# Altium schematic sheet mpu_power.SchDoc
size A3; SheetNumber: 4; SheetTotal: 5
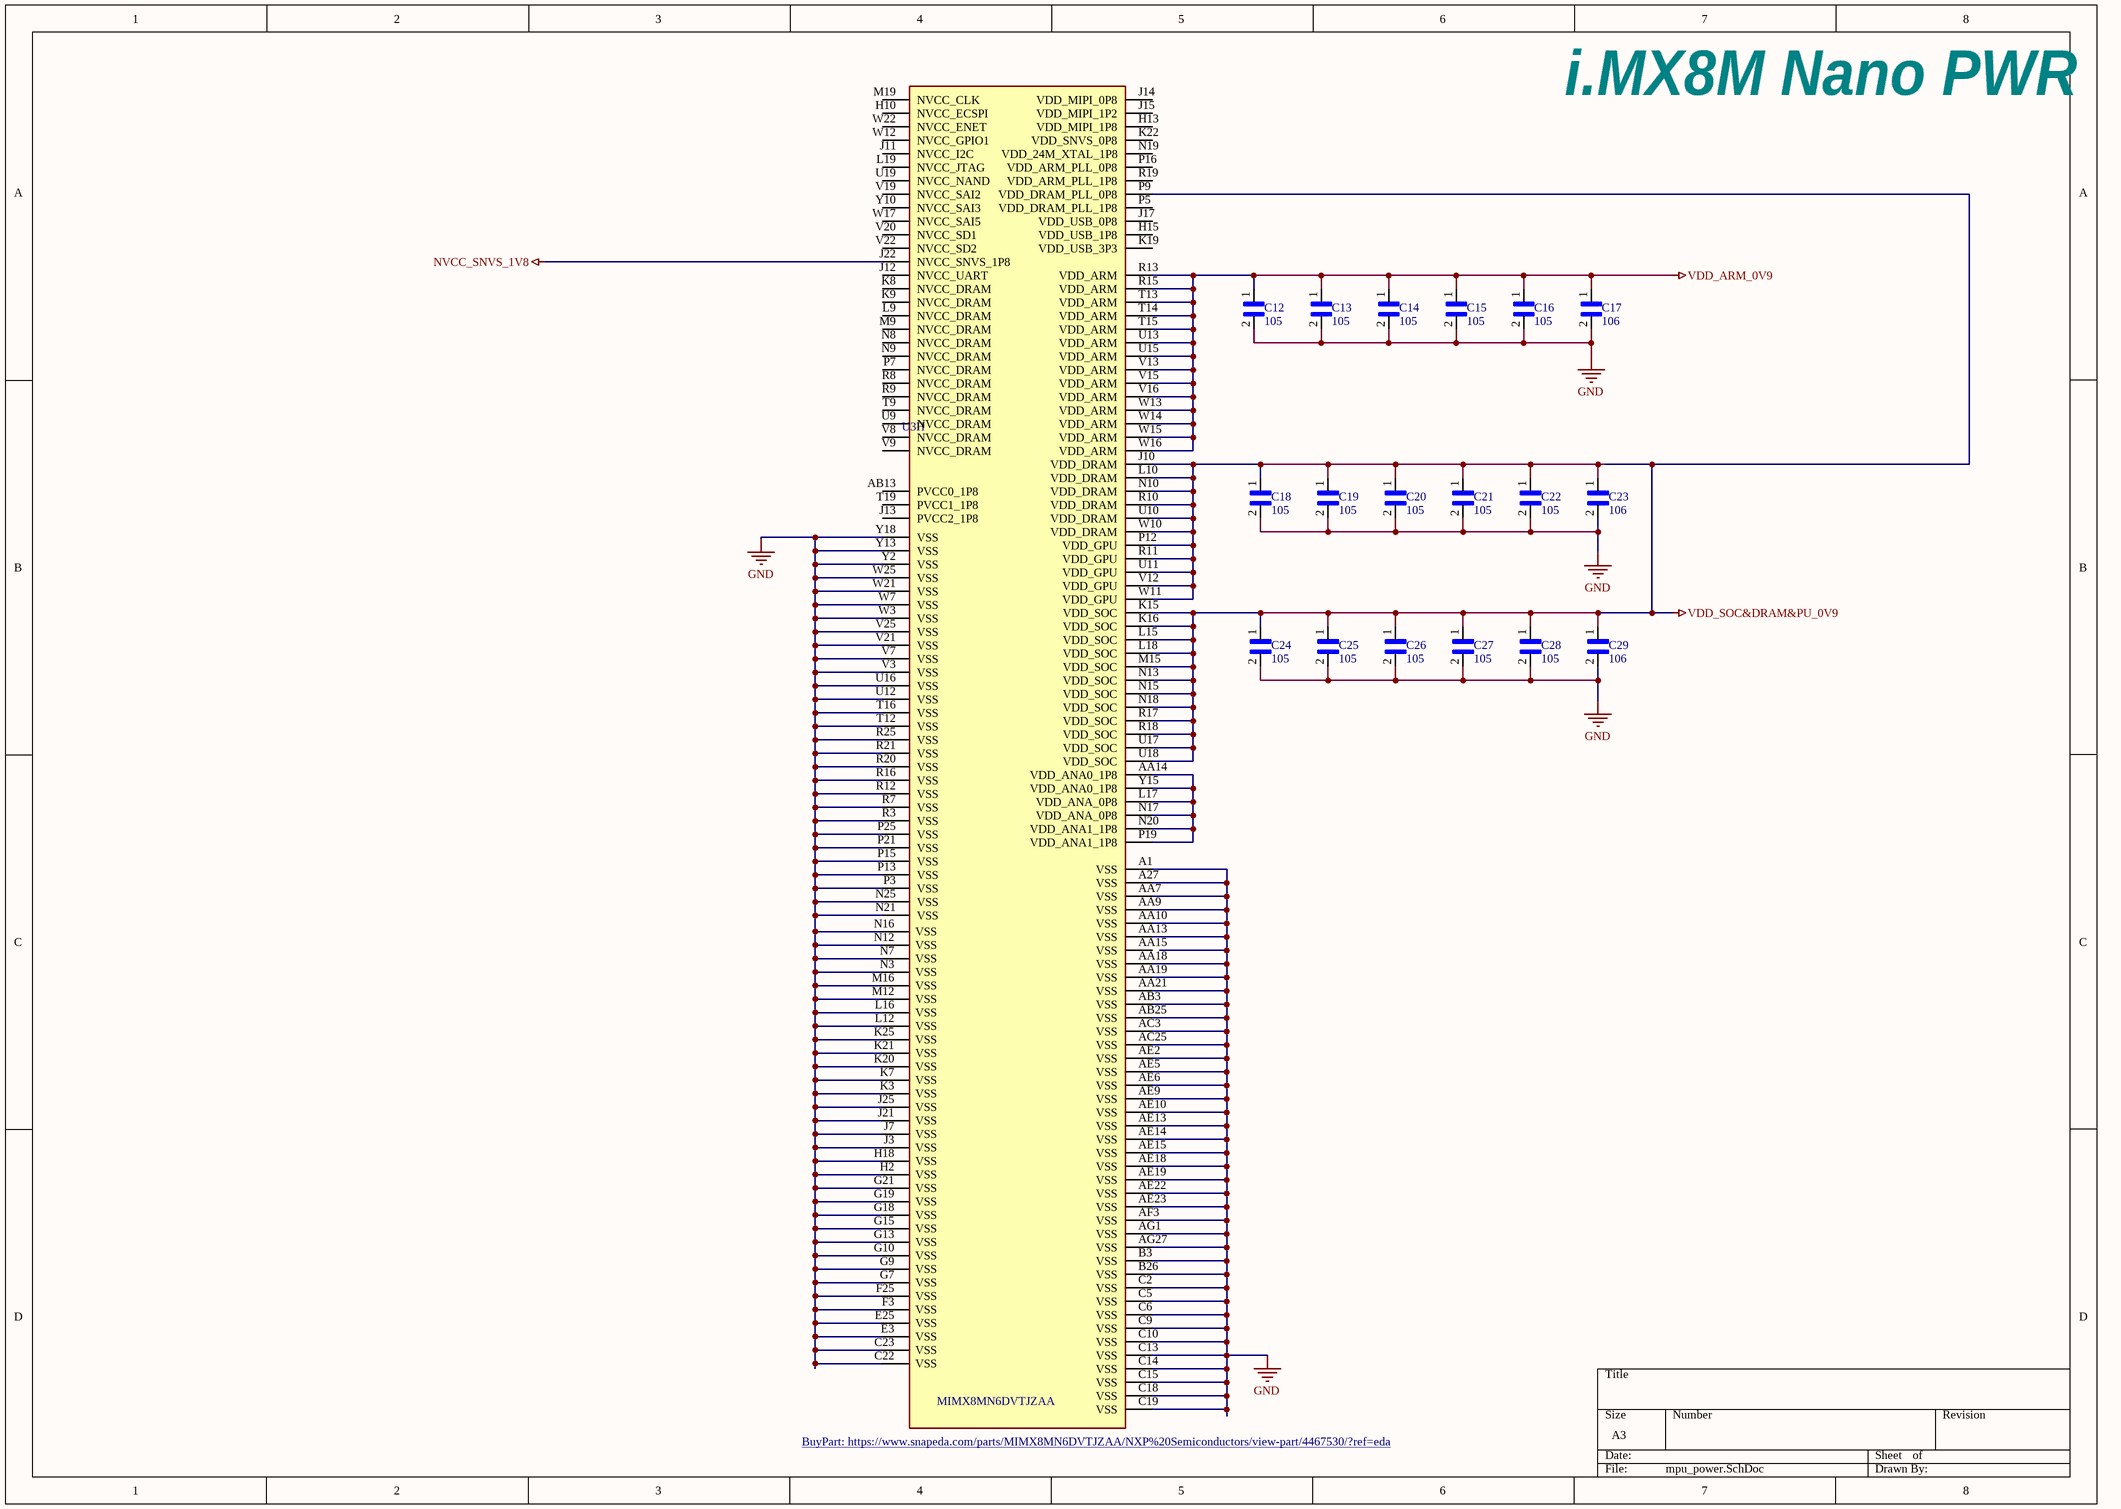
[diagram p0: mpu_power.SchDoc]

## Parts
C12  105  [RC0402]
C13  105  [RC0402]
C14  105  [RC0402]
C15  105  [RC0402]
C16  105  [RC0402]
C17  106  [CL05A106MQ5NUNC]
C18  105  [RC0402]
C19  105  [RC0402]
C20  105  [RC0402]
C21  105  [RC0402]
C22  105  [RC0402]
C23  106  [CL05A106MQ5NUNC]
C24  105  [RC0402]
C25  105  [RC0402]
C26  105  [RC0402]
C27  105  [RC0402]
C28  105  [RC0402]
C29  106  [CL05A106MQ5NUNC]
U3  MIMX8MN6DVTJZAA  [BGA486N50P27X27_1400X1400X125N]  (part H of 8)

## Nets
GND: C12.2 C13.2 C14.2 C15.2 C16.2 C17.2 C18.2 C19.2 C20.2 C21.2 C22.2 C23.2 C24.2 C25.2 C26.2 C27.2 C28.2 C29.2 U3.A1(VSS) U3.A27(VSS) U3.AA7(VSS) U3.AA9(VSS) U3.AA10(VSS) U3.AA13(VSS) U3.AA18(VSS) U3.AA19(VSS) U3.AA21(VSS) U3.AB3(VSS) U3.AB25(VSS) U3.AC3(VSS) U3.AC25(VSS) U3.AE2(VSS) U3.AE5(VSS) U3.AE6(VSS) U3.AE9(VSS) U3.AE10(VSS) U3.AE13(VSS) U3.AE14(VSS) U3.AE15(VSS) U3.AE18(VSS) U3.AE19(VSS) U3.AE22(VSS) U3.AE23(VSS) U3.AF3(VSS) U3.AG1(VSS) U3.AG27(VSS) U3.B3(VSS) U3.B26(VSS) U3.C2(VSS) U3.C5(VSS) U3.C6(VSS) U3.C9(VSS) U3.C10(VSS) U3.C13(VSS) U3.C14(VSS) U3.C15(VSS) U3.C18(VSS) U3.C19(VSS) U3.C22(VSS) U3.C23(VSS) U3.E3(VSS) U3.E25(VSS) U3.F3(VSS) U3.F25(VSS) U3.G7(VSS) U3.G9(VSS) U3.G10(VSS) U3.G13(VSS) U3.G15(VSS) U3.G18(VSS) U3.G19(VSS) U3.G21(VSS) U3.H2(VSS) U3.H18(VSS) U3.J3(VSS) U3.J7(VSS) U3.J21(VSS) U3.J25(VSS) U3.K3(VSS) U3.K7(VSS) U3.K20(VSS) U3.K21(VSS) U3.K25(VSS) U3.L12(VSS) U3.L16(VSS) U3.M12(VSS) U3.M16(VSS) U3.N3(VSS) U3.N7(VSS) U3.N12(VSS) U3.N16(VSS) U3.N21(VSS) U3.N25(VSS) U3.P3(VSS) U3.P13(VSS) U3.P15(VSS) U3.P21(VSS) U3.P25(VSS) U3.R3(VSS) U3.R7(VSS) U3.R12(VSS) U3.R16(VSS) U3.R20(VSS) U3.R21(VSS) U3.R25(VSS) U3.T12(VSS) U3.T16(VSS) U3.U12(VSS) U3.U16(VSS) U3.V3(VSS) U3.V7(VSS) U3.V21(VSS) U3.V25(VSS) U3.W3(VSS) U3.W7(VSS) U3.W21(VSS) U3.W25(VSS) U3.Y2(VSS) U3.Y13(VSS) U3.Y18(VSS)
NVCC_SNVS_1V8: U3.J22(NVCC_SNVS_1P8)
VDD_ARM_0V9: C12.1 C13.1 C14.1 C15.1 C16.1 C17.1 U3.R13(VDD_ARM) U3.R15(VDD_ARM) U3.T13(VDD_ARM) U3.T14(VDD_ARM) U3.T15(VDD_ARM) U3.U13(VDD_ARM) U3.U15(VDD_ARM) U3.V13(VDD_ARM) U3.V15(VDD_ARM) U3.V16(VDD_ARM) U3.W13(VDD_ARM) U3.W14(VDD_ARM) U3.W15(VDD_ARM) U3.W16(VDD_ARM)
VDD_SOC&DRAM&PU_0V9: C18.1 C19.1 C20.1 C21.1 C22.1 C23.1 C24.1 C25.1 C26.1 C27.1 C28.1 C29.1 U3.J10(VDD_DRAM) U3.K15(VDD_SOC) U3.K16(VDD_SOC) U3.L10(VDD_DRAM) U3.L15(VDD_SOC) U3.L18(VDD_SOC) U3.M15(VDD_SOC) U3.N10(VDD_DRAM) U3.N13(VDD_SOC) U3.N15(VDD_SOC) U3.N18(VDD_SOC) U3.P9(VDD_DRAM_PLL_0P8) U3.P12(VDD_GPU) U3.R10(VDD_DRAM) U3.R11(VDD_GPU) U3.R17(VDD_SOC) U3.R18(VDD_SOC) U3.U10(VDD_DRAM) U3.U11(VDD_GPU) U3.U17(VDD_SOC) U3.U18(VDD_SOC) U3.V12(VDD_GPU) U3.W10(VDD_DRAM) U3.W11(VDD_GPU)
NetU3_AA14: U3.AA14(VDD_ANA0_1P8) U3.L17(VDD_ANA_0P8) U3.N17(VDD_ANA_0P8) U3.N20(VDD_ANA1_1P8) U3.P19(VDD_ANA1_1P8) U3.Y15(VDD_ANA0_1P8)

Not connected (* = marked no-connect by the designer): U3 AA15(VSS) AB13(PVCC0_1P8) H10(NVCC_ECSPI) H13(VDD_MIPI_1P8) H15(VDD_USB_1P8) J11(NVCC_I2C) J12(NVCC_UART) J13(PVCC2_1P8) J14(VDD_MIPI_0P8) J15(VDD_MIPI_1P2) J17(VDD_USB_0P8) K8(NVCC_DRAM) K9(NVCC_DRAM) K19(VDD_USB_3P3) K22(VDD_SNVS_0P8) L9(NVCC_DRAM) L19(NVCC_JTAG) M9(NVCC_DRAM) M19(NVCC_CLK) N8(NVCC_DRAM) N9(NVCC_DRAM) N19(VDD_24M_XTAL_1P8) P5(VDD_DRAM_PLL_1P8) P7(NVCC_DRAM) P16(VDD_ARM_PLL_0P8) R8(NVCC_DRAM) R9(NVCC_DRAM) R19(VDD_ARM_PLL_1P8) T9(NVCC_DRAM) T19(PVCC1_1P8) U9(NVCC_DRAM) U19(NVCC_NAND) V8(NVCC_DRAM) V9(NVCC_DRAM) V19(NVCC_SAI2) V20(NVCC_SD1) V22(NVCC_SD2) W12(NVCC_GPIO1) W17(NVCC_SAI5) W22(NVCC_ENET) Y10(NVCC_SAI3)

## Notes on the sheet
- i.MX8M Nano PWR

## Library data of the parts
C12-C16 C18-C22 C24-C28 = CC0402KRX5R5BB105: Multilayer Ceramic Capacitor, 1 uF, 100 V, ï¿½ 10%, X7R, 0402 [1005 Metric]; Manufacturer: Yageo; Capacitance: 1uF; Voltage Rating: 6.3V; Dielectric: X5R; Temperature Coefficient: 30ppm/°C; Supplier 1: Digikey; Manufacturer Part Number: CC0402KRX5R5BB105; RoHS: Yes; Category: Ceramic Capacitors; Stock 1: 21136934; Pricing 1: 1=0.1, 10=0.054, 100=0.0318, 1000=0.02066, 2500=0.01646, 5000=0.01625 (USD); Mount: Surface Mount; Case/Package: 0402; Number of Pins: 2; Case Code (Metric): 1005; Case Code (Imperial): 0402; Dielectric Material: Ceramic; Material: Ceramic; Min Operating Temperature: -55°C; Max Operating Temperature: 85°C; Tolerance: 10%; Voltage Rating (DC): 6.3V; Packaging: Tape and Reel; Termination: SMD/SMT; Series: CC; Voltage Rating (AC): 6.3V; Length: 1mm; Width: 0.5mm; Height: 0.5mm; Depth: 0.5mm; Radiation Hardening: No; Reach SVHC Compliant: No; Lead Free: Lead Free; RoHS Compliant: Yes; Halogen Free: 5694HalogenFree; ComponentLink1URL: https://datasheet.ciiva.com/5789/70765-5789520.pdf?src-supplier=Farnell; ComponentLink1Description: https://datasheet.ciiva.com/5789/70765-5789520.pdf?src-supplier=Farnell; ComponentLink2URL: https://datasheet.ciiva.com/176/mlccorderingcode-176609.pdf?src-supplier=Digikey; ComponentLink2Description: https://datasheet.ciiva.com/176/mlccorderingcode-176609.pdf?src-supplier=Digikey; ComponentLink3URL: https://datasheet.ciiva.com/176/mlccorderingcode-176610.pdf?src-supplier=Digikey; ComponentLink3Description: https://datasheet.ciiva.com/176/mlccorderingcode-176610.pdf?src-supplier=Digikey; ComponentLink4URL: https://datasheet.ciiva.com/176/mlccorderingcode-176611.pdf?src-supplier=Digikey; ComponentLink4Description: https://datasheet.ciiva.com/176/mlccorderingcode-176611.pdf?src-supplier=Digikey; ComponentLink5URL: https://datasheet.ciiva.com/11464/upy-gphc-x5r-4v-to-50v-12-11464863.pdf?src-supplier=Avnet; ComponentLink5Description: https://datasheet.ciiva.com/11464/upy-gphc-x5r-4v-to-50v-12-11464863.pdf?src-supplier=Avnet; ComponentLink6URL: https://datasheet.ciiva.com/8033/1525783-8033643.pdf?src-supplier=Element14; ComponentLink6Description: https://datasheet.ciiva.com/8033/1525783-8033643.pdf?src-supplier=Element14; ComponentLink7URL: https://datasheet.ciiva.com/8033/1525783-8033644.pdf?src-supplier=Element14; ComponentLink7Description: https://datasheet.ciiva.com/8033/1525783-8033644.pdf?src-supplier=Element14; ComponentLink8URL: https://datasheet.ciiva.com/8033/70765-8033646.pdf?src-supplier=Element14; ComponentLink8Description: https://datasheet.ciiva.com/8033/70765-8033646.pdf?src-supplier=Element14; ComponentLink9URL: https://datasheet.ciiva.com/28450/1359354-28450285.pdf?src-supplier=Element14; ComponentLink9Description: https://datasheet.ciiva.com/28450/1359354-28450285.pdf?src-supplier=Element14; Supplier Part Number 1: 311-1438-1-ND
C17 C23 C29 = CL05A106MQ5NUNC: Multilayer Ceramic Capacitor, 10 uF, 6.3 V, ï¿½ 20%, X5R, 0402 [1005 Metric]; Manufacturer: Samsung; Capacitance: 10uF; Voltage Rating: 6.3V; Supplier 1: Avnet; Manufacturer Part Number: CL05A106MQ5NUNC; RoHS: Yes; Category: Ceramic Capacitors; Stock 1: 540000; Pricing 1: 10000=0.02499, 20000=0.02486, 40000=0.02474, 60000=0.02461, 80000=0.02448 (USD); Mount: Surface Mount; Case/Package: 0402; Case Code (Metric): 1005; Case Code (Imperial): 0402; Min Operating Temperature: -55°C; Max Operating Temperature: 85°C; Packaging: Tape and Reel; Tolerance: 20%; Package Quantity: 1; Dielectric: X5R; Series: CL; Construction: Flat; Length: 1mm; Width: 0.02inch; Height: 0.5mm; Thickness: 0.028inch; Depth: 0.5mm; Radiation Hardening: No; RoHS Compliant: Yes; ComponentLink1URL: https://datasheet.ciiva.com/16437/cl05a106mq5nunc-16437356.pdf?src-supplier=Future+Electronics; ComponentLink1Description: https://datasheet.ciiva.com/16437/cl05a106mq5nunc-16437356.pdf?src-supplier=Future+Electronics; ComponentLink2URL: https://datasheet.ciiva.com/26877/getdatasheetpartid-355289-26877841.pdf?src-supplier=Verical; ComponentLink2Description: https://datasheet.ciiva.com/26877/getdatasheetpartid-355289-26877841.pdf?src-supplier=Verical; Supplier Part Number 1: CL05A106MQ5NUNC
U3 = MIMX8MN6DVTJZAA: ARMÂ® CortexÂ®-A53 Microprocessor IC i.MX8MN 4 Core, 32-Bit 1.5GHz 486-LFBGA (14x14); MF: NXP USA Inc.; Package: LFBGA-486 NXP USA Inc.; Price: None; Mouser-Purchase-URL: https://snapeda.com/shop?store=Mouser&id=4467530; Availability: Warning; MP: MIMX8MN6DVTJZAA; SnapEDA_Link: https://www.snapeda.com/parts/MIMX8MN6DVTJZAA/NXP%20Semiconductors/view-part/4467530/?ref=snap; Value: *; Arrow_Electronics-Purchase-URL: https://snapeda.com/shop?store=Arrow+Electronics&id=4467530; BuyPart: https://www.snapeda.com/parts/MIMX8MN6DVTJZAA/NXP%20Semiconductors/view-part/4467530/?ref=eda